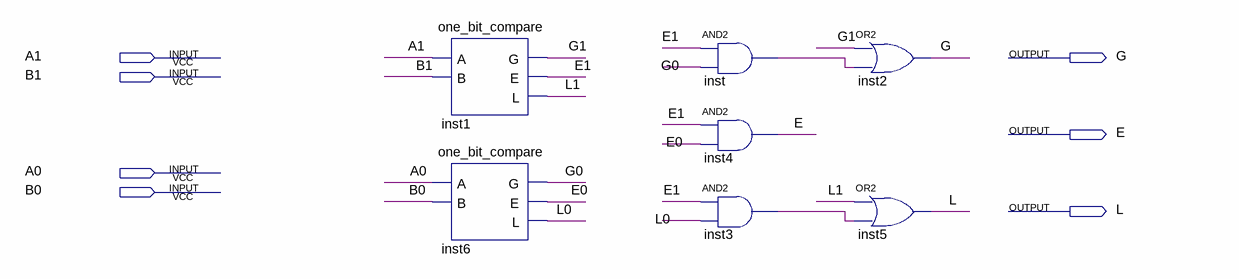
[diagram p0: schematic sheet]
// Quartus schematic two_bit_compare.bdf as structural Verilog: 7 symbols, 7 pins
module two_bit_compare (
  input  A1,
  input  B1,
  input  A0,
  input  B0,
  output G,
  output E,
  output L
);

  wire E0, E1, G0, G1, inst3_out, inst_out, L0, L1;

  one_bit_compare inst1 (.A(A1), .B(B1), .G(G1), .E(E1), .L(L1));
  one_bit_compare inst6 (.A(A0), .B(B0), .G(G0), .E(E0), .L(L0));
  and inst (inst_out, E1, G0);
  and inst4 (E, E1, E0);
  and inst3 (inst3_out, E1, L0);
  or inst2 (G, G1, inst_out);
  or inst5 (L, L1, inst3_out);
endmodule
